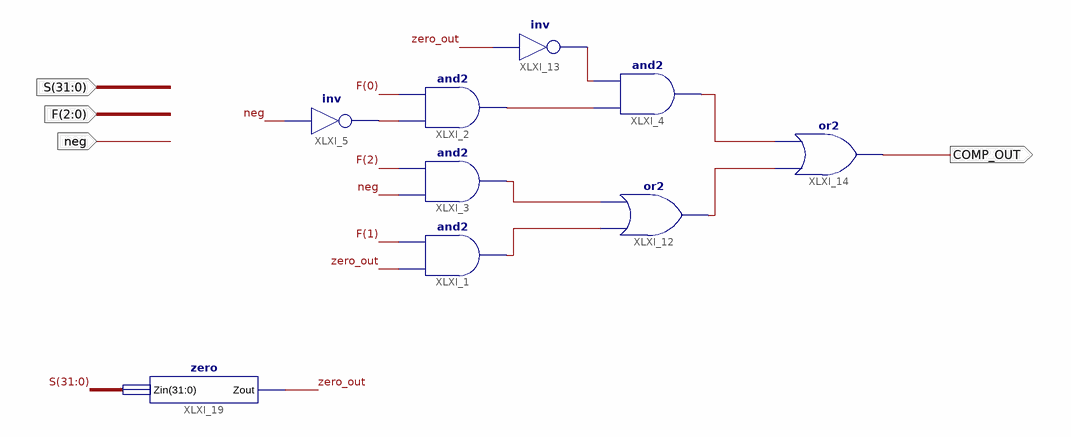
[diagram p0: schematic sheet 1]
// Xilinx ISE schematic comp.sch (spartan2) as structural Verilog: 9 symbols, 4 ports
module comp (
  input  [2:0] F,
  input  [31:0] S,
  input  neg,
  output COMP_OUT
);

  wire XLXN_11, XLXN_15, XLXN_16, XLXN_36, XLXN_40, XLXN_47, XLXN_48, zero_out;

  and XLXI_4 (XLXN_47, XLXN_15, XLXN_36);
  and XLXI_2 (XLXN_15, XLXN_11, F[0]);
  not XLXI_5 (XLXN_11, neg);
  and XLXI_3 (XLXN_16, neg, F[2]);
  and XLXI_1 (XLXN_40, zero_out, F[1]);
  or XLXI_12 (XLXN_48, XLXN_40, XLXN_16);
  not XLXI_13 (XLXN_36, zero_out);
  or XLXI_14 (COMP_OUT, XLXN_48, XLXN_47);
  zero XLXI_19 (.Zin(S), .Zout(zero_out));
endmodule
